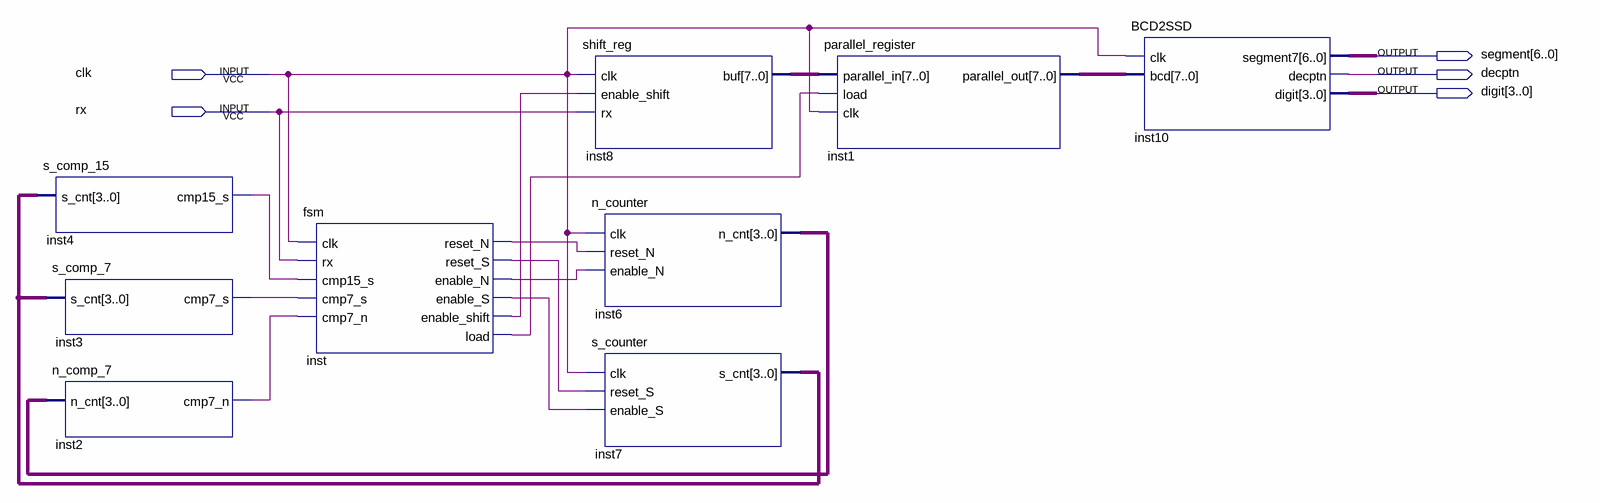
[diagram p0: schematic sheet]
// Quartus schematic Group_16.bdf as structural Verilog: 9 symbols, 5 pins
module Group_16 (
  input  clk,
  input  rx,
  output [6:0] segment,
  output decptn,
  output [3:0] digit
);

  wire inst2_cmp7_n, inst3_cmp7_s, inst4_cmp15_s, inst_enable_n, inst_enable_s, inst_enable_shift, inst_load,
       inst_reset_n, inst_reset_s;
  wire [3:0] inst6_n_cnt, inst7_s_cnt;
  wire [7:0] inst1_parallel_out, inst8_buf;

  s_comp_15 inst4 (.s_cnt(inst7_s_cnt), .cmp15_s(inst4_cmp15_s));
  s_comp_7 inst3 (.s_cnt(inst7_s_cnt), .cmp7_s(inst3_cmp7_s));
  n_comp_7 inst2 (.n_cnt(inst6_n_cnt), .cmp7_n(inst2_cmp7_n));
  fsm inst (
    .clk(clk), .rx(rx), .cmp15_s(inst4_cmp15_s), .cmp7_s(inst3_cmp7_s), .cmp7_n(inst2_cmp7_n),
    .reset_N(inst_reset_n), .reset_S(inst_reset_s), .enable_N(inst_enable_n), .enable_S(inst_enable_s),
    .enable_shift(inst_enable_shift), .load(inst_load));
  shift_reg inst8 (.clk(clk), .enable_shift(inst_enable_shift), .rx(rx), .\buf (inst8_buf));
  n_counter inst6 (.clk(clk), .reset_N(inst_reset_n), .enable_N(inst_enable_n), .n_cnt(inst6_n_cnt));
  s_counter inst7 (.clk(clk), .reset_S(inst_reset_s), .enable_S(inst_enable_s), .s_cnt(inst7_s_cnt));
  parallel_register inst1 (.parallel_in(inst8_buf), .load(inst_load), .clk(clk), .parallel_out(inst1_parallel_out));
  BCD2SSD inst10 (.clk(clk), .bcd(inst1_parallel_out), .segment7(segment), .decptn(decptn), .digit(digit));
endmodule
